# Altium project Mynd_AMP.PrjPcb
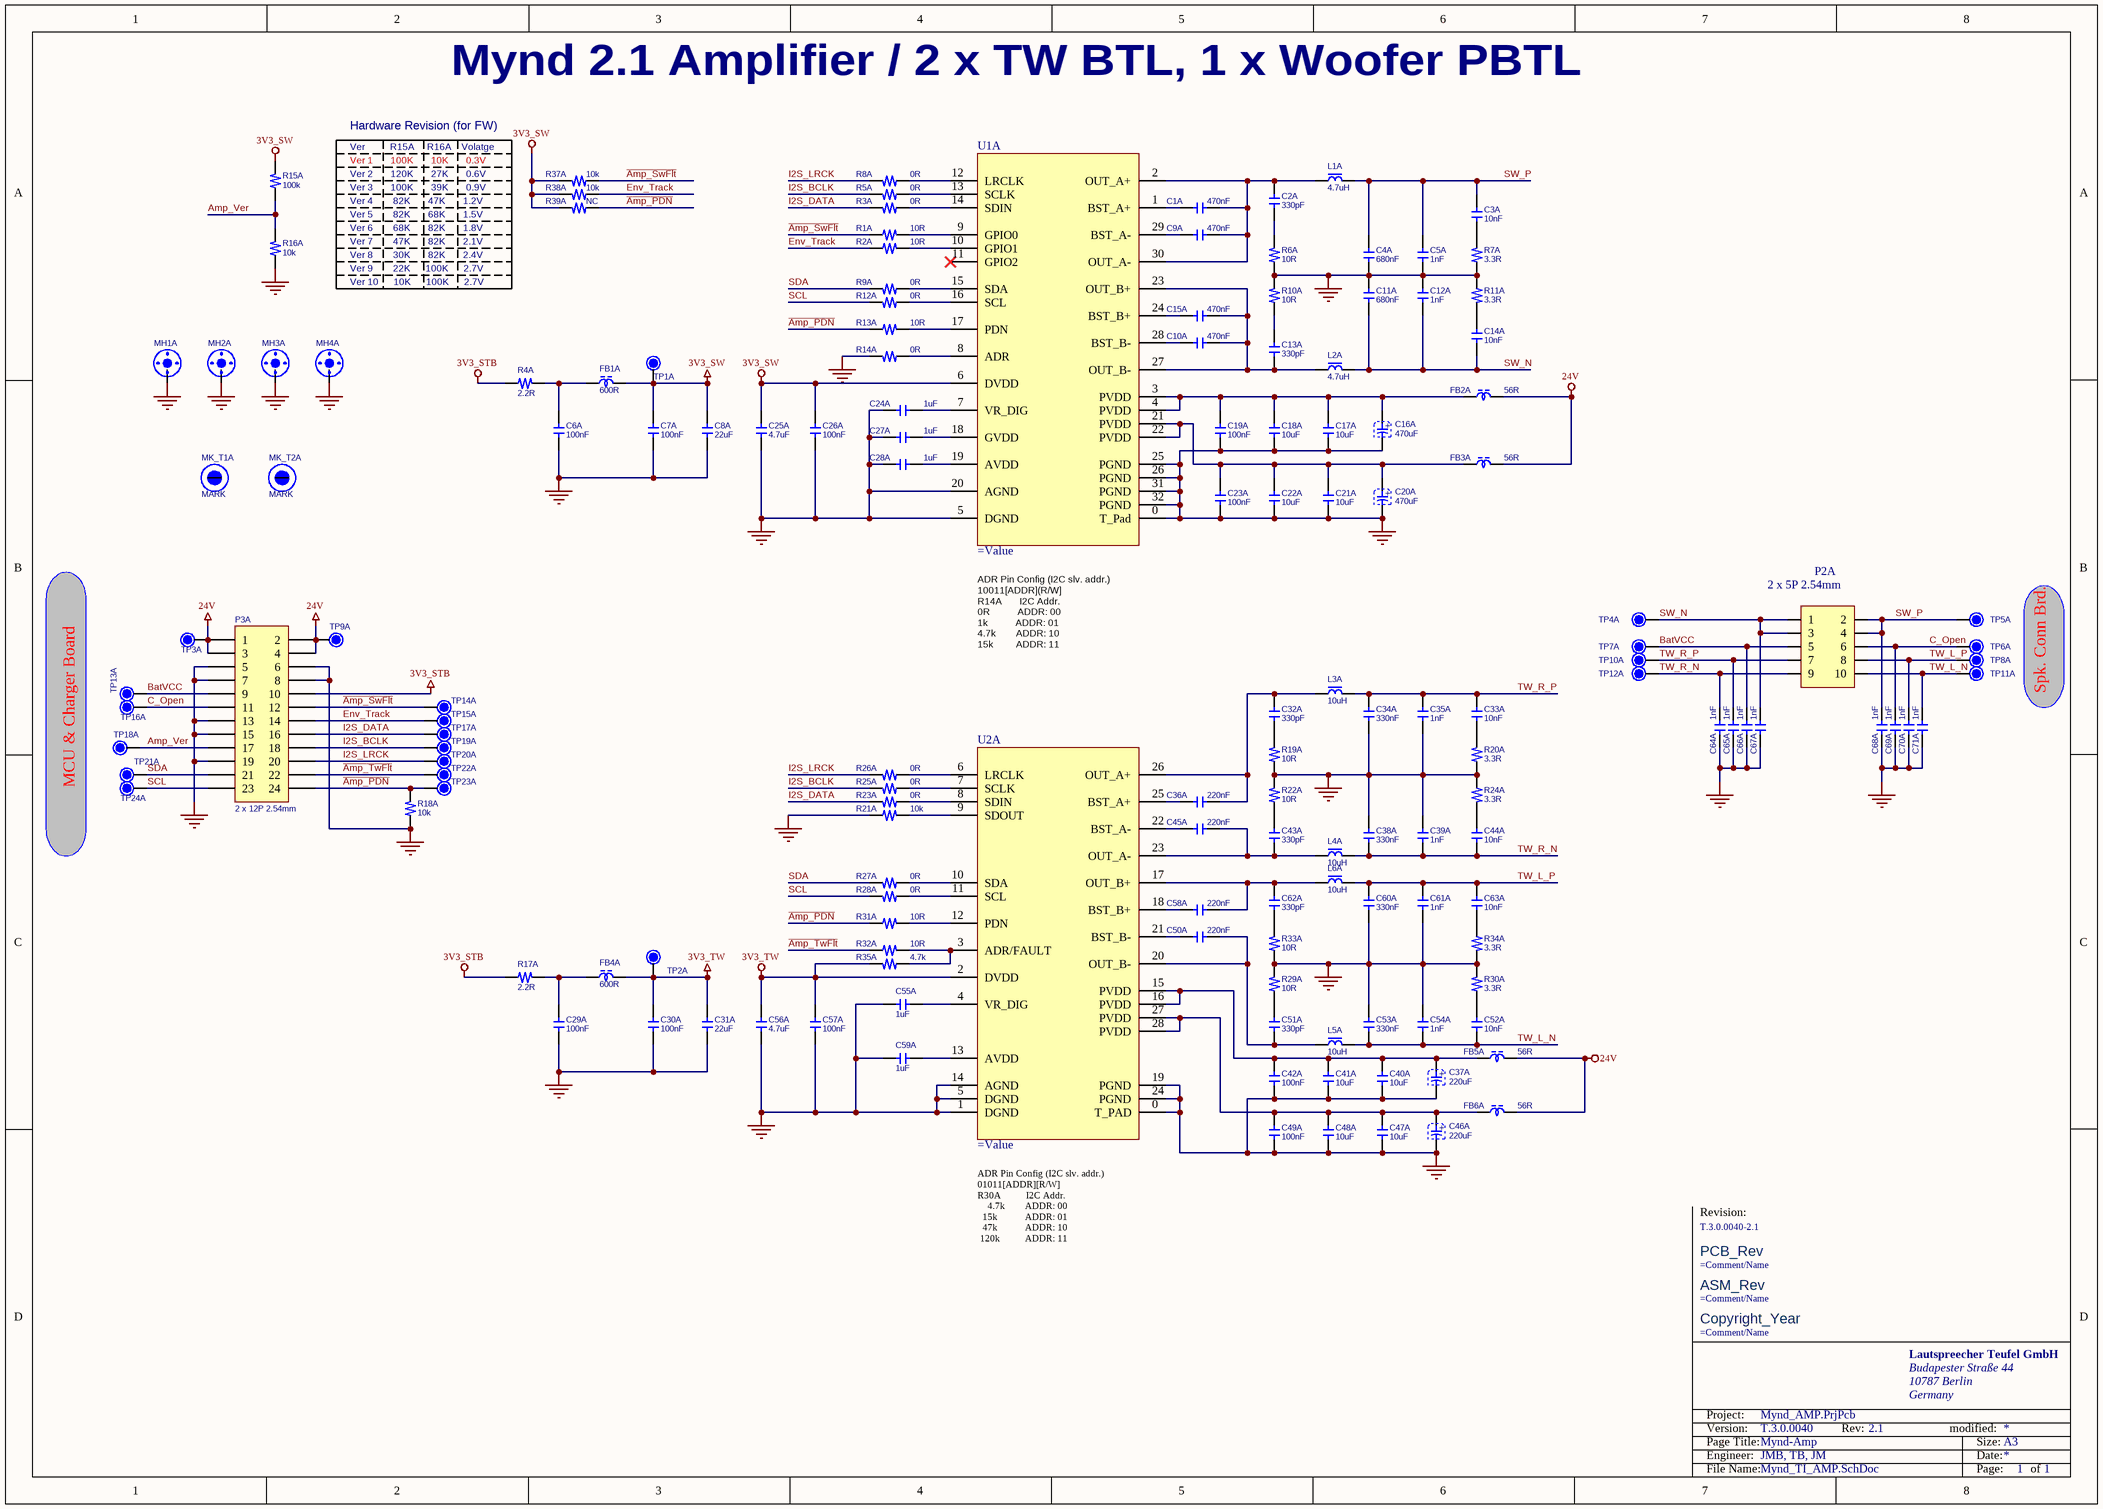
[diagram p0: Mynd_TI_AMP.SchDoc]
Address1: Budapester Straße 44; Address2: 10787 Berlin; Address3: Germany; ASM_Rev: 2.1; CompanyName: Lautsprecher Teufel GmbH; Copyright_Year: 2023; DOC_NO_SCH_DWG: Mynd_AMP; Engineer: JMB, TB, JM; PCB_REV: 2.1; QBOM-AIEQ-NUMBER: AIEPS2307-Q0A1; QBOM-APE-NUMBER: APEPS2307-00A1; QBOM-APEQ-NUMBER: APEPS2307-Q0A1; QBOM-L-NUMBER: LFAPS2307-H001; Revision: 2.1; SCH_REV: 2.1; SCH_Title: Mynd; Version: T.3.0.0040
1 sheet, 159 parts. Net scope: global (net labels, ports and power ports of the same name join across sheets).
Board file: Mynd_TI_Amp.PcbDoc

## Sheet Mynd_TI_AMP.SchDoc: Mynd-Amp
size A3; PageSetup: Record=PageOptions|CenterHorizontal=True|CenterVertical=True|PrintScale=0.70|XCorrection=1.00|YCorrection=1.00|PrintKind=0|BorderSize=5000000|LeftOffset=0|BottomOffset=0|Orientation=2|PaperLength=1000|PaperWidth=1000|Scale=100|PaperSource=7|PrintQuality=-4|MediaType=1|DitherType=10|PaperKind=A4|PrintScaleMode=1; ApprovedBy: JianHua.Zhong; CheckedBy: Aileen.Zheng; DrawnBy: GuoHui.Lin; Revision: 2.1; SheetNumber: 1; SheetTotal: 1; Model NO.: PS2302; ISSUE DATE: 20230822; REV DATE: 20231025

### Parts
C1A  470nF  [C0603X100]
C2A  330pF  [C0603X80]
C3A  10nF  [C0603X100]
C4A  680nF  [C0805_125]
C5A  1nF  [C0805_125]
C6A  100nF  [C0603X105]
C7A  100nF  [C0603X105]
C8A  22uF  [C0805_145]
C9A  470nF  [C0603X100]
C10A  470nF  [C0603X100]
C11A  680nF  [C0805_125]
C12A  1nF  [C0805_125]
C13A  330pF  [C0603X80]
C14A  10nF  [C0603X100]
C15A  470nF  [C0603X100]
C16A  470uF  [ECAP_SMD_1000X1000]
C17A  10uF  [C1206]
C18A  10uF  [C1206]
C19A  100nF  [C0603X105]
C20A  470uF  [ECAP_SMD_1000X1000]
C21A  10uF  [C1206]
C22A  10uF  [C1206]
C23A  100nF  [C0603X105]
C24A  1uF  [C0603X105]
C25A  4.7uF  [C0805_145]
C26A  100nF  [C0603X105]
C27A  1uF  [C0603X105]
C28A  1uF  [C0603X105]
C29A  100nF  [C0603X105]
C30A  100nF  [C0603X105]
C31A  22uF  [C0805_145]
C32A  330pF  [C0603X80]
C33A  10nF  [C0603X100]
C34A  330nF  [C0805_125]
C35A  1nF  [C0805_125]
C36A  220nF  [C0603X100]
C37A  220uF  [ECAP_SMD_800X1000]
C38A  330nF  [C0805_125]
C39A  1nF  [C0805_125]
C40A  10uF  [C1206]
C41A  10uF  [C1206]
C42A  100nF  [C0603X105]
C43A  330pF  [C0603X80]
C44A  10nF  [C0603X100]
C45A  220nF  [C0603X100]
C46A  220uF  [ECAP_SMD_800X1000]
C47A  10uF  [C1206]
C48A  10uF  [C1206]
C49A  100nF  [C0603X105]
C50A  220nF  [C0603X100]
C51A  330pF  [C0603X80]
C52A  10nF  [C0603X100]
C53A  330nF  [C0805_125]
C54A  1nF  [C0805_125]
C55A  1uF  [C0603X105]
C56A  4.7uF  [C0805_145]
C57A  100nF  [C0603X105]
C58A  220nF  [C0603X100]
C59A  1uF  [C0603X105]
C60A  330nF  [C0805_125]
C61A  1nF  [C0805_125]
C62A  330pF  [C0603X80]
C63A  10nF  [C0603X100]
C64A  1nF  [C0805_125]
C65A  1nF  [C0805_125]
C66A  1nF  [C0805_125]
C67A  1nF  [C0805_125]
C68A  1nF  [C0805_125]
C69A  1nF  [C0805_125]
C70A  1nF  [C0805_125]
C71A  1nF  [C0805_125]
FB1A  600R  [L0603]
FB2A  56R  [L1612]
FB3A  56R  [L1612]
FB4A  600R  [L0603]
FB5A  56R  [L1612]
FB6A  56R  [L1612]
L1A  4.7uH  [IND_SMD_YT_SQU_L78XW70XH50]
L2A  4.7uH  [IND_SMD_YT_SQU_L78XW70XH50]
L3A  10uH  [IND_SMD_YT_SQU_L78XW70XH30]
L4A  10uH  [IND_SMD_YT_SQU_L78XW70XH30]
L5A  10uH  [IND_SMD_YT_SQU_L78XW70XH30]
L6A  10uH  [IND_SMD_YT_SQU_L78XW70XH30]
MH1A  SCREW_HOLE_D32  [SCREW_D32]  (value not drawn)  (no BOM)
MH2A  SCREW_HOLE_D32  [SCREW_D32]  (value not drawn)  (no BOM)
MH3A  SCREW_HOLE_D32  [SCREW_D32]  (value not drawn)  (no BOM)
MH4A  SCREW_HOLE_D32  [SCREW_D32]  (value not drawn)  (no BOM)
MK_T1A  MARK  [MARK]  (no BOM)
MK_T2A  MARK  [MARK]  (no BOM)
P2A  2 x 5P 2.54mm  [female_2X5_254]
P3A  2 x 12P 2.54mm  [Pin_Header_SMD_2X12_254]
R1A  10R  [R0603]
R2A  10R  [R0603]
R3A  0R  [R0603]
R4A  2.2R  [R0603]
R5A  0R  [R0603]
R6A  10R  [R1206]
R7A  3.3R  [R0603]
R8A  0R  [R0603]
R9A  0R  [R0603]
R10A  10R  [R1206]
R11A  3.3R  [R0603]
R12A  0R  [R0603]
R13A  10R  [R0603]
R14A  0R  [R0603]
R15A  100k  [R0603]
R16A  10k  [R0603]
R17A  2.2R  [R0603]
R18A  10k  [R0603]
R19A  10R  [R1206]
R20A  3.3R  [R0603]
R21A  10k  [R0603]
R22A  10R  [R1206]
R23A  0R  [R0603]
R24A  3.3R  [R0603]
R25A  0R  [R0603]
R26A  0R  [R0603]
R27A  0R  [R0603]
R28A  0R  [R0603]
R29A  10R  [R1206]
R30A  3.3R  [R0603]
R31A  10R  [R0603]
R32A  10R  [R0603]
R33A  10R  [R1206]
R34A  3.3R  [R0603]
R35A  4.7k  [R0603]
R37A  10k  [R0603]
R38A  10k  [R0603]
R39A  NC  [R0603]
Teufel_ASM_Label1A  (no value)  [Teufel_ASM_Rev]  (no BOM)
Teufel_Copyright1A  (no value)  [TEUFEL_COPYRIGHT]  (no BOM)
Teufel_PCB_Label1A  (no value)  [Teufel_PCB_Rev]  (no BOM)
Teufel_PCB_Logo1A  T.3.0.0040-2.1  [Teufel_NoLogo]  (no BOM)
TP1A  TP_T_60_40  [TP_T_60_40]  (value not drawn)  (no BOM)
TP2A  TP_T_60_40  [TP_T_60_40]  (value not drawn)  (no BOM)
TP3A  TP12  [TP120]  (value not drawn)  (no BOM)
TP4A  TP12  [TP120]  (value not drawn)  (no BOM)
TP5A  TP12  [TP120]  (value not drawn)  (no BOM)
TP6A  TP12  [TP120]  (value not drawn)  (no BOM)
TP7A  TP12  [TP120]  (value not drawn)  (no BOM)
TP8A  TP12  [TP120]  (value not drawn)  (no BOM)
TP9A  TP12  [TP120]  (value not drawn)  (no BOM)
TP10A  TP12  [TP120]  (value not drawn)  (no BOM)
TP11A  TP12  [TP120]  (value not drawn)  (no BOM)
TP12A  TP12  [TP120]  (value not drawn)  (no BOM)
TP13A  TP12  [TP120]  (value not drawn)  (no BOM)
TP14A  TP12  [TP120]  (value not drawn)  (no BOM)
TP15A  TP12  [TP120]  (value not drawn)  (no BOM)
TP16A  TP12  [TP120]  (value not drawn)  (no BOM)
TP17A  TP12  [TP120]  (value not drawn)  (no BOM)
TP18A  TP12  [TP120]  (value not drawn)  (no BOM)
TP19A  TP12  [TP120]  (value not drawn)  (no BOM)
TP20A  TP12  [TP120]  (value not drawn)  (no BOM)
TP21A  TP12  [TP120]  (value not drawn)  (no BOM)
TP22A  TP12  [TP120]  (value not drawn)  (no BOM)
TP23A  TP12  [TP120]  (value not drawn)  (no BOM)
TP24A  TP12  [TP120]  (value not drawn)  (no BOM)
U1A  (no value)  [QFN32_500X500X100_50_P350X350]
U2A  (no value)  [TSSOP28(PWP)]

### Nets
3V3_STB: P3A.10 R4A.2 R17A.2
3V3_SW: C7A.1 C8A.1 C25A.1 C26A.1 FB1A.2 R15A.1 R37A.1 R38A.1 R39A.1 TP1A.1 U1A.6(DVDD)
3V3_TW: C30A.1 C31A.1 C56A.1 C57A.1 FB4A.2 R35A.1 TP2A.1 U2A.2(DVDD)
24V: FB2A.1 FB3A.1 FB5A.1 FB6A.2 P3A.1 P3A.2 P3A.3 P3A.4 TP3A.1 TP9A.1
GND: C4A.2 C5A.2 C6A.2 C7A.2 C8A.2 C11A.2 C12A.2 C16A.2 C17A.2 C18A.2 C19A.2 C20A.2 C21A.2 C22A.2 C23A.2 C24A.1 C25A.2 C26A.2 C27A.1 C28A.1 C29A.2 C30A.2 C31A.2 C34A.2 C35A.2 C37A.2 C38A.2 C39A.2 C40A.2 C41A.2 C42A.2 C46A.2 C47A.2 C48A.2 C49A.2 C53A.2 C54A.2 C55A.1 C56A.2 C57A.2 C59A.1 C60A.2 C61A.2 C64A.2 C65A.2 C66A.2 C67A.2 C68A.2 C69A.2 C70A.2 C71A.2 MH1A.1 MH2A.1 MH3A.1 MH4A.1 P3A.5 P3A.6 P3A.7 P3A.8 P3A.13 P3A.15 P3A.19 R6A.2 R7A.2 R10A.1 R11A.2 R14A.1 R16A.2 R18A.2 R19A.2 R20A.2 R21A.2 R22A.1 R24A.2 R29A.2 R30A.2 R33A.1 R34A.2 U1A.0(T_Pad) U1A.5(DGND) U1A.20(AGND) U1A.25(PGND) U1A.26(PGND) U1A.31(PGND) U1A.32(PGND) U2A.0(T_PAD) U2A.1(DGND) U2A.5(DGND) U2A.14(AGND) U2A.19(PGND) U2A.24(PGND)
~{Amp_PDN}: P3A.24 R13A.2 R18A.1 R31A.2 R39A.2 TP23A.1
~{Amp_SwFlt}: P3A.12 R1A.2 R37A.2 TP14A.1
~{Amp_TwFlt}: P3A.22 R32A.2 TP22A.1
Amp_Ver: P3A.17 R15A.2 R16A.1 TP18A.1
BatVCC: C66A.1 P2A.5 P3A.9 TP7A.1 TP13A.1
C_Open: C69A.1 P2A.6 P3A.11 TP6A.1 TP16A.1
Env_Track: P3A.14 R2A.2 R38A.2 TP15A.1
I2S_BCLK: P3A.18 R5A.1 R25A.1 TP19A.1
I2S_DATA: P3A.16 R3A.1 R23A.1 TP17A.1
I2S_LRCK: P3A.20 R8A.1 R26A.1 TP20A.1
SCL: P3A.23 R12A.1 R28A.1 TP24A.1
SDA: P3A.21 R9A.1 R27A.1 TP21A.1
SW_N: C11A.1 C12A.1 C14A.2 C67A.1 L2A.2 P2A.1 P2A.3 TP4A.1
SW_P: C3A.1 C4A.1 C5A.1 C68A.1 L1A.2 P2A.2 P2A.4 TP5A.1
TW_L_N: C52A.1 C53A.1 C54A.1 C71A.1 L5A.2 P2A.10 TP11A.1
TW_L_P: C60A.1 C61A.1 C63A.2 C70A.1 L6A.2 P2A.8 TP8A.1
TW_R_N: C38A.1 C39A.1 C44A.2 C64A.1 L4A.2 P2A.9 TP12A.1
TW_R_P: C33A.1 C34A.1 C35A.1 C65A.1 L3A.2 P2A.7 TP10A.1
NetC1A_1: C1A.1 C2A.2 C9A.2 L1A.1 U1A.2(OUT_A+) U1A.30(OUT_A-)
NetC1A_2: C1A.2 U1A.1(BST_A+)
NetC2A_1: C2A.1 R6A.1
NetC3A_2: C3A.2 R7A.1
NetC6A_1: C6A.1 FB1A.1 R4A.1
NetC9A_1: C9A.1 U1A.29(BST_A-)
NetC10A_1: C10A.1 C13A.1 C15A.2 L2A.1 U1A.23(OUT_B+) U1A.27(OUT_B-)
NetC10A_2: C10A.2 U1A.28(BST_B-)
NetC13A_2: C13A.2 R10A.2
NetC14A_1: C14A.1 R11A.1
NetC15A_1: C15A.1 U1A.24(BST_B+)
NetC16A_1: C16A.1 C17A.1 C18A.1 C19A.1 FB2A.2 U1A.3(PVDD) U1A.4(PVDD)
NetC20A_1: C20A.1 C21A.1 C22A.1 C23A.1 FB3A.2 U1A.21(PVDD) U1A.22(PVDD)
NetC24A_2: C24A.2 U1A.7(VR_DIG)
NetC27A_2: C27A.2 U1A.18(GVDD)
NetC28A_2: C28A.2 U1A.19(AVDD)
NetC29A_1: C29A.1 FB4A.1 R17A.1
NetC32A_1: C32A.1 R19A.1
NetC32A_2: C32A.2 C36A.1 L3A.1 U2A.26(OUT_A+)
NetC33A_2: C33A.2 R20A.1
NetC36A_2: C36A.2 U2A.25(BST_A+)
NetC37A_1: C37A.1 C40A.1 C41A.1 C42A.1 FB5A.2 U2A.15(PVDD) U2A.16(PVDD)
NetC43A_1: C43A.1 C45A.2 L4A.1 U2A.23(OUT_A-)
NetC43A_2: C43A.2 R22A.2
NetC44A_1: C44A.1 R24A.1
NetC45A_1: C45A.1 U2A.22(BST_A-)
NetC46A_1: C46A.1 C47A.1 C48A.1 C49A.1 FB6A.1 U2A.27(PVDD) U2A.28(PVDD)
NetC50A_1: C50A.1 C51A.2 L5A.1 U2A.20(OUT_B-)
NetC50A_2: C50A.2 U2A.21(BST_B-)
NetC51A_1: C51A.1 R29A.1
NetC52A_2: C52A.2 R30A.1
NetC55A_2: C55A.2 U2A.4(VR_DIG)
NetC58A_1: C58A.1 U2A.18(BST_B+)
NetC58A_2: C58A.2 C62A.1 L6A.1 U2A.17(OUT_B+)
NetC59A_2: C59A.2 U2A.13(AVDD)
NetC62A_2: C62A.2 R33A.2
NetC63A_1: C63A.1 R34A.1
NetR1A_1: R1A.1 U1A.9(GPIO0)
NetR2A_1: R2A.1 U1A.10(GPIO1)
NetR3A_2: R3A.2 U1A.14(SDIN)
NetR5A_2: R5A.2 U1A.13(SCLK)
NetR8A_2: R8A.2 U1A.12(LRCLK)
NetR9A_2: R9A.2 U1A.15(SDA)
NetR12A_2: R12A.2 U1A.16(SCL)
NetR13A_1: R13A.1 U1A.17(PDN)
NetR14A_2: R14A.2 U1A.8(ADR)
NetR21A_1: R21A.1 U2A.9(SDOUT)
NetR23A_2: R23A.2 U2A.8(SDIN)
NetR25A_2: R25A.2 U2A.7(SCLK)
NetR26A_2: R26A.2 U2A.6(LRCLK)
NetR27A_2: R27A.2 U2A.10(SDA)
NetR28A_2: R28A.2 U2A.11(SCL)
NetR31A_1: R31A.1 U2A.12(PDN)
NetR32A_1: R32A.1 R35A.2 U2A.3(ADR/FAULT)

Not connected (* = marked no-connect by the designer): MK_T1A MK_B MK_T; MK_T2A MK_B MK_T; U1A 11(GPIO2)*

### Notes on the sheet
- Mynd 2.1 Amplifier / 2 x TW BTL, 1 x Woofer PBTL
- Ver 1       100K       10K       0.3V
- Ver          R15A     R16A    Volatge
- Hardware Revision (for FW)
- Ver 2       120K       27K       0.6V
- Ver 3       100K       39K       0.9V
- Ver 4        82K       47K       1.2V
- Ver 5        82K       68K       1.5V
- Ver 6        68K       82K       1.8V
- Ver 7        47K       82K       2.1V
- Ver 8        30K       82K       2.4V
- Ver 9        22K      100K      2.7V
- Ver 10      10K      100K      2.7V
- ADR Pin Config (I2C slv. addr.)
  10011[ADDR](R/W]
  R14A       I2C Addr.
  0R           ADDR: 00
  1k           ADDR: 01
  4.7k        ADDR: 10
  15k         ADDR: 11
- Spk. Conn Brd.
- MCU & Charger Board
- ADR Pin Config (I2C slv. addr.)
  01011[ADDR][R/W]
  R30A          I2C Addr.
  4.7k        ADDR: 00
  15k           ADDR: 01
  47k           ADDR: 10
  120k          ADDR: 11
- Revision:
- Lautspreecher Teufel GmbH
- Budapester Straße 44
- 10787 Berlin
- Germany
- Page Title:
- Engineer:
- Project:
- Version:
- Rev:
- modified:
- Date:
- Size:
- A3
- File Name:
- Page:
- of
- (in symbol CMP-00086-3) Copyright_Year
- (in symbol CMP-00087-3) PCB_Rev
- (in symbol CMP-00088-3) ASM_Rev
- (in symbol P-001-0142-39) +
- (in symbol P-001-0309-22) +

### Library data of the parts
C1A C9A C10A C15A = P-001-0125-21: PSHF SMD M CAP 470nF 50V ±10% 0603 X7R; Manufacturer: Multi-Sourced; Part_Number: Generic; Part_Type: Capacitor ceramic SMT; Tolerance: ±10%; TemperatureRange: X7R; Value: 470nF; Voltage: 50V
C2A C13A C32A C43A C51A C62A = P-001-0387-45: PSHF SMD M CAP 330pF 50V ±5% 0603 NPO; Manufacturer: Multi-Sourced; Part_Number: Generic; Part_Type: Capacitor ceramic SMT; Tolerance: ±5%; TemperatureRange: NPO; Value: 330pF; Voltage: 50V
C3A C14A C33A C44A C52A C63A = P-001-0058-45: PSHF SMD M CAP 10nF 50V ±10% 0603 X7R; Manufacturer: Multi-Sourced; Part_Number: Generic; Part_Type: Capacitor ceramic SMT; Tolerance: ±10%; TemperatureRange: X7R; Value: 10nF; Voltage: 50V
C4A C11A = P-001-0156-16: PSHF SMD M CAP 680nF 50V ±10% 0805 X7R; Manufacturer: Multi-Sourced; Part_Number: Generic; Part_Type: Capacitor ceramic SMT; Tolerance: ±10%; TemperatureRange: X7R; Value: 680nF; Voltage: 50V
C5A C12A C35A C39A C54A C61A C64A C65A C66A C67A C68A C69A C70A C71A = P-001-0183-42: PSHF SMD M CAP 0.001uF 50V ±10% 0805 X7R; Manufacturer: Multi-Sourced; Part_Number: Generic; Part_Type: Capacitor ceramic SMT; Tolerance: ±10%; TemperatureRange: X7R; Value: 1nF; Voltage: 50V
C6A C7A C19A C23A C26A C29A C30A C42A C49A C57A = P-001-0008-44: PSHF SMD M CAP 100nF 50V ±5% 0603 X7R; Manufacturer: Multi-Sourced; Part_Number: Generic; Part_Type: Capacitor ceramic SMT; Tolerance: ±5%; TemperatureRange: X7R; Value: 100nF; Voltage: 50V
C8A C31A = P-001-0128-57: PSHF SMD M CAP 22uF 10V ±20% 0805 X5R; Manufacturer: Multi-Sourced; Part_Number: Generic; Part_Type: Capacitor ceramic SMT; Tolerance: ±20%; TemperatureRange: X5R; Value: 22uF; Voltage: 10V
C16A C20A = P-001-0309-22: PS SMD COND ELECT 470uF 35V ±20% 105℃; Manufacturer: Multi-Sourced; Part_Number: Generic; Part_Type: Capacitor electrolytic SMT; Tolerance: ±20%; TemperatureRange: 105℃; Value: 470uF; Voltage: 35V
C17A C18A C21A C22A C40A C41A C47A C48A = P-001-0200-18: PSHF SMD M CAP 10uF 50V ±10% 1206 X5R; Manufacturer: Multi-Sourced; Part_Number: Generic; Part_Type: Capacitor ceramic SMT; Tolerance: ±10%; TemperatureRange: X5R; Value: 10uF; Voltage: 50V
C24A C27A C28A C55A C59A = P-001-0065-40: PSHF SMD M CAP 1uF 50V ±10% 0603 X7R; Manufacturer: Multi-Sourced; Part_Number: Generic; Part_Type: Capacitor ceramic SMT; Tolerance: ±10%; TemperatureRange: X7R; Value: 1uF; Voltage: 50V
C25A C56A = P-001-0169-16: PSHF SMD M CAP 4.7uF 25V ±10% 0805 X7R; Manufacturer: Multi-Sourced; Part_Number: Generic; Part_Type: Capacitor ceramic SMT; Tolerance: ±10%; TemperatureRange: X7R; Value: 4.7uF; Voltage: 25V
C34A C38A C53A C60A = P-001-0155-17: PSHF SMD M CAP 330nF 50V ±10% 0805 X7R; Manufacturer: Multi-Sourced; Part_Number: Generic; Part_Type: Capacitor ceramic SMT; Tolerance: ±10%; TemperatureRange: X7R; Value: 330nF; Voltage: 50V
C36A C45A C50A C58A = P-001-0092-31: PSHF SMD M CAP 220nF 50V ±10% 0603 X7R; Manufacturer: Multi-Sourced; Part_Number: Generic; Part_Type: Capacitor ceramic SMT; Tolerance: ±10%; TemperatureRange: X7R; Value: 220nF; Voltage: 50V
C37A C46A = P-001-0142-39: PS SMD COND ELECT 220uF 35V ±20% 105℃; Manufacturer: [LELON]; Part_Number: Generic; Part_Type: Capacitor electrolytic SMT; Tolerance: ±20%; TemperatureRange: 105℃; Value: 220uF; Voltage: 35V
FB1A FB4A = S-001-0008-33: PSHF SMD FERRITE BEAD 600OHM 25% 0603; Manufacturer: TSA; Part_Type: Ferrite Bead SMT; Current: 2A; Tolerance: 1:25%; Frequency: 100MHZ; Value: 600R
FB2A FB3A FB5A FB6A = S-001-0416-2: SMD FERRITE BEAD 56Ohm 25% 1612; Manufacturer: TSA; Part_Type: Ferrite Bead SMT; Current: 10A; Tolerance: 1:25%; Frequency: 100MHz; Value: 56R
L1A L2A = S-001-0041-29: PS INDUCTOR 4.7uH 20% 6.5A 7.8x7x4.8; Manufacturer: CHAMPIONS; Part_Type: Inductor SMT; Voltage: 1V; Tolerance: 7:20%; Frequency: 100KHz; Current: 6.5A; Value: 4.7uH
L3A L4A L5A L6A = S-001-0042-38: GP SMD INDUCTOR 10uH 1MHz 1V NORM; Manufacturer: [CHAMPIONS]; Part_Type: Inductor SMT; Current: 4A; Tolerance: 7:20%; Voltage: 1V; Frequency: 1MHz; Value: 10uH
MH1A MH2A MH3A MH4A = N-001-00005-4: SCREW_HOLE D3.2mm; Design Item ID: SCREW_HOLE
MK_T1A MK_T2A = N-001-00003-2: MARK DOT; Design Item ID: MARK
P2A = C-001-1096-5: SMD BTB CONNECTOR 10P P2.54mm GOLD; Manufacturer: MINGHENG; Part_Type: Connector SMT; System: Connector; Value: 2 x 5P 2.54mm
P3A = C-001-1094-3: SMD BTB CONNECTOR 24P P2.54mm GOLD; Manufacturer: MINGHENG; Part_Type: Connector SMT; System: Connector; Value: 2 x 12P 2.54mm
R1A R2A R13A R31A R32A = Q-001-0042-68: PS SMD RES. 10OHM 1/10W 5% 0603; Part_Type: Resistor SMT; Manufacturer: Multi-Sourced; Part_Number: Generic; Tolerance: 1%; Value: 10R; Wattage: 1/10W
R3A R5A R8A R9A = Q-001-0048-199: PS SMD RES. 0OHM 1/10W 5% 0603; Part_Type: Resistor SMT; Manufacturer: Multi-Sourced; Part_Number: Generic; Tolerance: 1%; Value: 0R; Wattage: 1/10W
R4A R17A = Q-001-0264-41: PS SMD RES. 2.2OHM 1/10W 5% 0603; Part_Type: Resistor SMT; Manufacturer: Multi-Sourced; Part_Number: Generic; Tolerance: 1%; Value: 2.2R; Wattage: 1/10W
R6A R10A R19A R22A R29A R33A = Q-001-0107-29: PS SMD RES. 10OHM 1/4W 5% 1206; Part_Type: Resistor SMT; Manufacturer: Multi-Sourced; Part_Number: Generic; Tolerance: 1%; Value: 10R; Wattage: 1/4W
R7A R11A R20A R24A R30A R34A = Q-001-0403-21: PS SMD RES. 3.3OHM 1/10W 1% 0603; Part_Type: Resistor SMT; Manufacturer: Multi-Sourced; Part_Number: Generic; Tolerance: 1%; Value: 3.3R; Wattage: 1/10W
R12A R14A R23A R25A R26A R27A R28A = Q-001-0048-200: PS SMD RES. 0OHM 1/10W 5% 0603; Part_Type: Resistor SMT; Manufacturer: Multi-Sourced; Part_Number: Generic; Tolerance: 1%; Value: 0R; Wattage: 1/10W
R15A = Q-001-0032-53: PS SMD RES. 100KOHM 1/10W 1% 0603; Manufacturer: Multi-Sourced; Part_Number: Generic; Part_Type: Resistor SMT; Tolerance: 1%; Wattage: 1/10W; Value: 100k
R16A R37A R38A R39A = Q-001-0036-48: PS SMD RES. 10KOHM 1/10W 1% 0603; Manufacturer: Multi-Sourced; Part_Number: Generic; Part_Type: Resistor SMT; Tolerance: 1%; Wattage: 1/10W
  R16A R37A R38A: Value: 10k
  R39A: Value: NC
R18A R21A = Q-001-0036-48: PS SMD RES. 10KOHM 1/10W 1% 0603; Part_Type: Resistor SMT; Manufacturer: Multi-Sourced; Part_Number: Generic; Tolerance: 1%; Value: 10k; Wattage: 1/10W
R35A = Q-001-0431-28: PS SMD RES. 4.7KOHM 1/10W 1% 0603; Part_Type: Resistor SMT; Manufacturer: Multi-Sourced; Part_Number: Generic; Tolerance: 1%; Value: 4.7k; Wattage: 1/10W
Teufel_ASM_Label1A = CMP-00088-3: Teufel_ASM_Rev
Teufel_Copyright1A = CMP-00086-3: Teufel_Copyright_Year
Teufel_PCB_Label1A = CMP-00087-3: Teufel_PCB_Label
Teufel_PCB_Logo1A = Teufel NoLogo: Teufel PCB NoLogo
TP1A TP2A = CMP-00089-1: Test Point; Design Item ID: TP
TP3A TP4A TP5A TP6A TP7A TP8A TP9A TP10A TP11A TP12A TP13A TP14A TP15A TP16A TP17A TP18A TP19A TP20A TP21A TP22A TP23A TP24A = N-001-00010-2: Test Point; Design Item ID: TP
U1A = R-001-0680-159: GP SMD IC 32P VQFN TAS5825PRHBR TI; Manufacturer: [TI]; Value: TAS5825PRHBR; Part_Number: TAS5825PRHBR
U2A = R-001-0684-13: GP SMD IC 28P HTSSOP TAS5805MPWPR TI; Manufacturer: [TI]; Value: TAS5805MPWPR; Part_Number: TAS5805MPWPR

## Assembly variants
Variant-of-NotFitted-Project: not fitted R39A